# Altium project atestare.PrjPcb
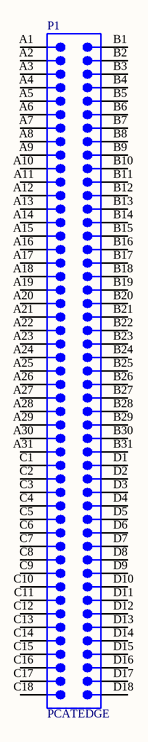
[diagram p0: AT long bus (13.3 x 4.2 inches).schdoc]
2 sheets, 11 parts. Net scope: global (net labels, ports and power ports of the same name join across sheets).
Board file: AT long bus (13.3 x 4.2 inches).PCBDOC
Sheets:
  AT long bus (13.3 x 4.2 inches).schdoc
  Sheet2.SchDoc

## Sheet AT long bus (13.3 x 4.2 inches).schdoc: AT long bus (13.3 x 4.2 inches)
size A; Organization: Organization; Address1: Address1; Address2: Address2; Address3: Address3; Address4: Address4; DocumentNumber: 1; Revision: 0; SheetNumber: 2; SheetTotal: 2

### Parts
P1  PCATEDGE  [PCATEDGE]

### Nets

Not connected (* = marked no-connect by the designer): P1 A1 A2 A3 A4 A5 A6 A7 A8 A9 A10 A11 A12 A13 A14 A15 A16 A17 A18 A19 A20 A21 A22 A23 A24 A25 A26 A27 A28 A29 A30 A31 B1 B2 B3 B4 B5 B6 B7 B8 B9 B10 B11 B12 B13 B14 B15 B16 B17 B18 B19 B20 B21 B22 B23 B24 B25 B26 B27 B28 B29 B30 B31 C1 C2 C3 C4 C5 C6 C7 C8 C9 C10 C11 C12 C13 C14 C15 C16 C17 C18 D1 D2 D3 D4 D5 D6 D7 D8 D9 D10 D11 D12 D13 D14 D15 D16 D17 D18

### Library data of the parts
P1 = PCATEDGE: Card, 98-Position; Text Field6: Alternate Layout Available; Text Field7: Published 14-Feb-2002

## Sheet Sheet2.SchDoc
size A
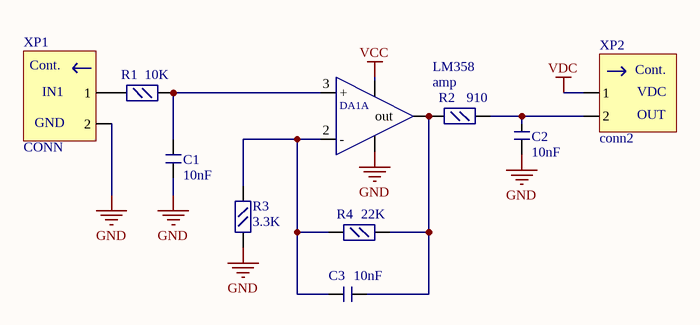
[diagram p1: Sheet2.SchDoc]

### Parts
C1  10nF
C2  10nF
C3  10nF
LM358  amp
R1  10K
R2  910
R3  3.3K
R4  22K
XP1  CONN
XP2  conn2

### Nets
GND: C1.9 C2.9 LM358.14 R3.7 XP1.18(2)
VCC: LM358.15
VDC: XP2.19(1)
NetC1_10: C1.10 LM358.3(+) R1.8
NetC2_10: C2.10 R2.8 XP2.19(2)
NetC3_9: C3.9 LM358.2(-) R3.8 R4.7
NetC3_10: C3.10 LM358.13(out) R2.7 R4.8
NetR1_7: R1.7 XP1.17(1)

### Notes on the sheet
- (in symbol amp) DA1A
- (in symbol CONN) Cont.; IN1; GND
- (in symbol conn2) Cont.; VDC; OUT

### Library data of the parts
C1-C3 = capacitor
R1-R4 = resistor